# Altium schematic sheet ethernet_1gbe_ext_magn.SchDoc
size A4
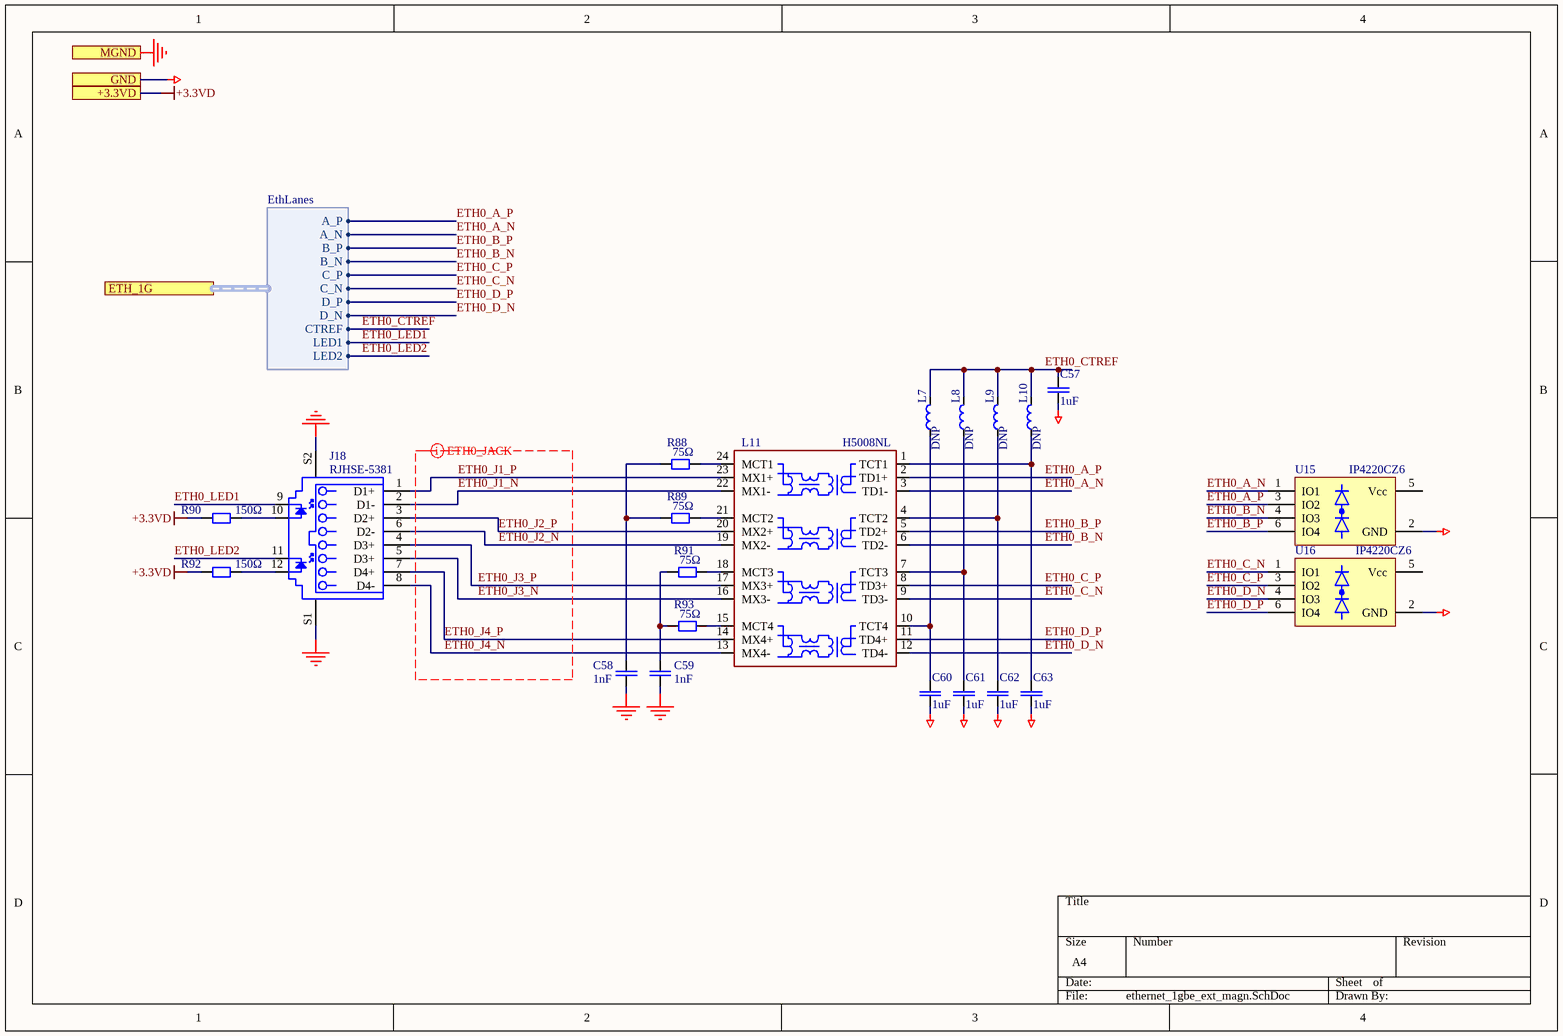
[diagram p0: ethernet_1gbe_ext_magn.SchDoc]

## Parts
C57  1uF  [CAPC2012N]
C58  value 1nF  [CAPC3216N]  (hidden comment: 1nF; 2kV)
C59  value 1nF  [CAPC3216N]  (hidden comment: 1nF; 2kV)
C60  1uF  [CAPC2012N]
C61  1uF  [CAPC2012N]
C62  1uF  [CAPC2012N]
C63  1uF  [CAPC2012N]
J18  RJHSE-5381  [AMPH-RJHSE-5381_V]
L7  DNP  [INDC2012N]
L8  DNP  [INDC2012N]
L9  DNP  [INDC2012N]
L10  DNP  [INDC2012N]
L11  H5008NL  [SMD_HX508]
R88  75Ω  [RESC2012N]
R89  75Ω  [RESC2012N]
R90  150Ω  [RESC2012N]
R91  75Ω  [RESC2012N]
R92  150Ω  [RESC2012N]
R93  75Ω  [RESC2012N]
U15  IP4220CZ6  [SOT95P285X110-6N]
U16  IP4220CZ6  [SOT95P285X110-6N]

## Ports
+3.3VD, ETH_1G (harness EthLanes), GND, MGND

## Harnesses
EthLanes: A_P, A_N, B_P, B_N, C_P, C_N, D_P, D_N, LED1, LED2, CTREF

## Nets
+3.3VD: R90.1 R92.1 ; port +3.3VD
GND: C57.1 C60.1 C61.1 C62.1 C63.1 U15.2(GND) U16.2(GND) ; port GND
MGND: C58.1 C59.1 J18.S1 J18.S2 ; port MGND
ETH0_A_N: L11.3(TD1-) U15.1(IO1) ; port ETH_1G.A_N
ETH0_A_P: L11.2(TD1+) U15.3(IO2) ; port ETH_1G.A_P
ETH0_B_N: L11.6(TD2-) U15.4(IO3) ; port ETH_1G.B_N
ETH0_B_P: L11.5(TD2+) U15.6(IO4) ; port ETH_1G.B_P
ETH0_C_N: L11.9(TD3-) U16.1(IO1) ; port ETH_1G.C_N
ETH0_C_P: L11.8(TD3+) U16.3(IO2) ; port ETH_1G.C_P
ETH0_CTREF: C57.2 L7.2 L8.2 L9.2 L10.2 ; port ETH_1G.CTREF
ETH0_D_N: L11.12(TD4-) U16.4(IO3) ; port ETH_1G.D_N
ETH0_D_P: L11.11(TD4+) U16.6(IO4) ; port ETH_1G.D_P
ETH0_J1_N: J18.2(D1-) L11.22(MX1-)
ETH0_J1_P: J18.1(D1+) L11.23(MX1+)
ETH0_J2_N: J18.6(D2-) L11.19(MX2-)
ETH0_J2_P: J18.3(D2+) L11.20(MX2+)
ETH0_J3_N: J18.5(D3+) L11.16(MX3-)
ETH0_J3_P: J18.4(D3+) L11.17(MX3+)
ETH0_J4_N: J18.8(D4-) L11.13(MX4-)
ETH0_J4_P: J18.7(D4+) L11.14(MX4+)
ETH0_LED1: J18.9 ; port ETH_1G.LED1
ETH0_LED2: J18.11 ; port ETH_1G.LED2
NetC58_2: C58.2 R88.1 R89.1
NetC59_2: C59.2 R91.1 R93.1
NetC60_2: C60.2 L7.1 L11.10(TCT4)
NetC61_2: C61.2 L8.1 L11.7(TCT3)
NetC62_2: C62.2 L9.1 L11.4(TCT2)
NetC63_2: C63.2 L10.1 L11.1(TCT1)
NetJ18_10: J18.10 R90.2
NetJ18_12: J18.12 R92.2
NetL11_15: L11.15(MCT4) R93.2
NetL11_18: L11.18(MCT3) R91.2
NetL11_21: L11.21(MCT2) R89.2
NetL11_24: L11.24(MCT1) R88.2

Not connected (* = marked no-connect by the designer): U15 5(Vcc); U16 5(Vcc)

## Layout directives
differential pair; rule Differential Pairs Routing [Pref Gap = 0.254mm    Min Gap  = 0.075mm    Max Gap  = 0.254mmPref Width = 0.3mm    Min Width  = 0.075mm    Max Width  = 0.5mm]: ETH0_J1_N, ETH0_J1_P, ETH0_J2_N, ETH0_J2_P, ETH0_J3_N, ETH0_J3_P, ETH0_J4_N, ETH0_J4_P

## Library data of the parts
C57 C60-C63 = CAPC: Generic ceramic SMD capacitor; Pkg: 0805; Maintainer: Evgeniy Kotov; SMD Solders: 2; THD Solders: 0; Voltage Rating: 10V; PartField: 1uF; Last Change Data: 06.03.2017; Release Date: 06.03.2017; Value: 1uF
C58 = CAPC: Generic ceramic SMD capacitor / +' x '+Voltage Rating; Pkg: 1206; Maintainer: Evgeniy Kotov; SMD Solders: 2; THD Solders: 0; PartField: 1nF; Last Change Data: 06.03.2017; Release Date: 06.03.2017; VoltageRating: 2kV
C59 = CAPC: Generic ceramic SMD capacitor; Pkg: 1206; Maintainer: Evgeniy Kotov; SMD Solders: 2; THD Solders: 0; PartField: 1nF; Last Change Data: 06.03.2017; Release Date: 06.03.2017; VoltageRating: 2kV
J18 = RJ45-RJHSE-5381: High Speed RJ45, Modular Jack, 8 Position, 8 Contacts, Shielded, with LEDs, -55 to 85 degC,12-Pin THD, RoHS, Tray; Manufacturer: Amphenol; Number of Positions/Contacts: 8p8c(RJ45,Ethernet); Number of Ports: 1; Catalog Drawings: RJ45SeriesRightAngle; PCN Design/Specification: MultipleSeriesCopper29/Jan/2009RJHSEShieldMaterial30/Jun/2015; Other Names: RJHSE5381; Online Catalog: RJHSESeries; Featured Product: ModularJacksProductSolutions; Tab Direction: Up; Shielding: Shielded,EMIFinger; LED Color: Yellow-Green; 3D Model: RJHSE538x.stpRJHSE538x.igs; Pkg: LAN conn; SMD Solders: 0; THD Solders: 14; Category: Connectors,Interconnects; Termination: Solder; Housing Material: Thermoplastic; Mounting Type: ThroughHole; Family: ModularConnectors-Jacks; Orientation: 90°Angle(Right); Features: BoardLock; Contact Material: PhosphorBronze; Mounting Technology: ThroughHole; Number of Rows: 1; Standard Package: 120; Ratings: -; Operating Temperature: -55°C~85°C; Series: RJHSE; Contact Finish: Gold; Package Reference: RJHSE-5381; Ingress Protection: -; Package Description: 12-Pin Through Hole Device, Body 16.51 x 15.75 mm; Contact Finish Thickness: 50µin(1.27µm); Datasheet URL: https://datasheet.ciiva.com/16481/rjhse538x-16481714.pdf; Datasheet Version: Rev. K, 04/2014; Connector Type: Jack; Manufacturer URL: http://www.amphenol.com/; Packaging: Tray; PartField: RJHSE-5381; Value: RJHSE-5381
L7-L10 = BLM21RK102SN1D: Ferrite Beads, 0805, 1 kOhm; Pkg: 0805; Vendor: Murata; Maintainer: Evgeniy Kotov; SMD Solders: 2; THD Solders: 0; DC Current: 200mA; Tolerance: 25%; DC Resistance: 500mΩ; PartField: BLM21RK102SN1D; Release Date: 30.03.2017; Last Change Data: 30.03.2017; Temperature Range: -55°C to +125°C; Value: DNP
L11 = LAN_1G_TR_H5008NL: LAN Transformer fog 1GbE, 12 coils, 4 pairs.; Vendor: Pulse Electronics; Maintainer: Evgeniy Kotov; SMD Solders: 2; THD Solders: 0; Tolerance: 2%; PartField: H5008NL; Pkg: H5008NL; Release Date: 31.03.2017; Last Change Data: 31.03.2017; Temperature Range: -25°C to +85°C; Value: H5008NL
R88-R93 = RESC: Resistor, Generic, SMD; Pkg: 0805; Maintainer: Evgeniy Kotov; SMD Solders: 2; THD Solders: 0; Release Date: 06.03.2017; Last Change Data: 09.03.2017
  R88 R89 R91 R93: PartField: 75Ω; Value: 75Ω
  R90 R92: PartField: 150Ω; Value: 150Ω
U15 U16 = IP4220CZ6: Transimpedance Amplifier; Selectable-Feedback Resistance; Pkg: SOT457; SMD Solders: 6; THD Solders: 0; Maintainer: Evgeniy Kotov; Vendor: NXP; PartField: IP4220CZ6; ComponentLink1URL: http://assets.nexperia.com/documents/data-sheet/IP4220CZ6.pdf; ComponentLink1Description: Datasheet; Last Change Date: 28.03.2017; Release Date: 28.03.2017; Value: IP4220CZ6